# Altium schematic sheet 01- Title Page.SchDoc: Title page
size 386 x 246 mm; Date:: Friday, Nov 22, 2019; Page Number: 1; Page Size: B; Comment: Lattice Title Block New Brand; Page Count: 14; Board Rev: B; Project Name: CrossLink-NX Evaluation Board; RevCode: 1.0; Doc: 305-PD-19-0819; DsnPath: C:\Users\HAltinkilit\Downloads\Crosslink-NX-Design-Files\CrossLink-NX-Eval-Brd-Schematic-RevB-191122.DSN; SchematicName: SCHEMATIC1; PageName: 01- Title Page; PageSize: B; TopSchematic: True
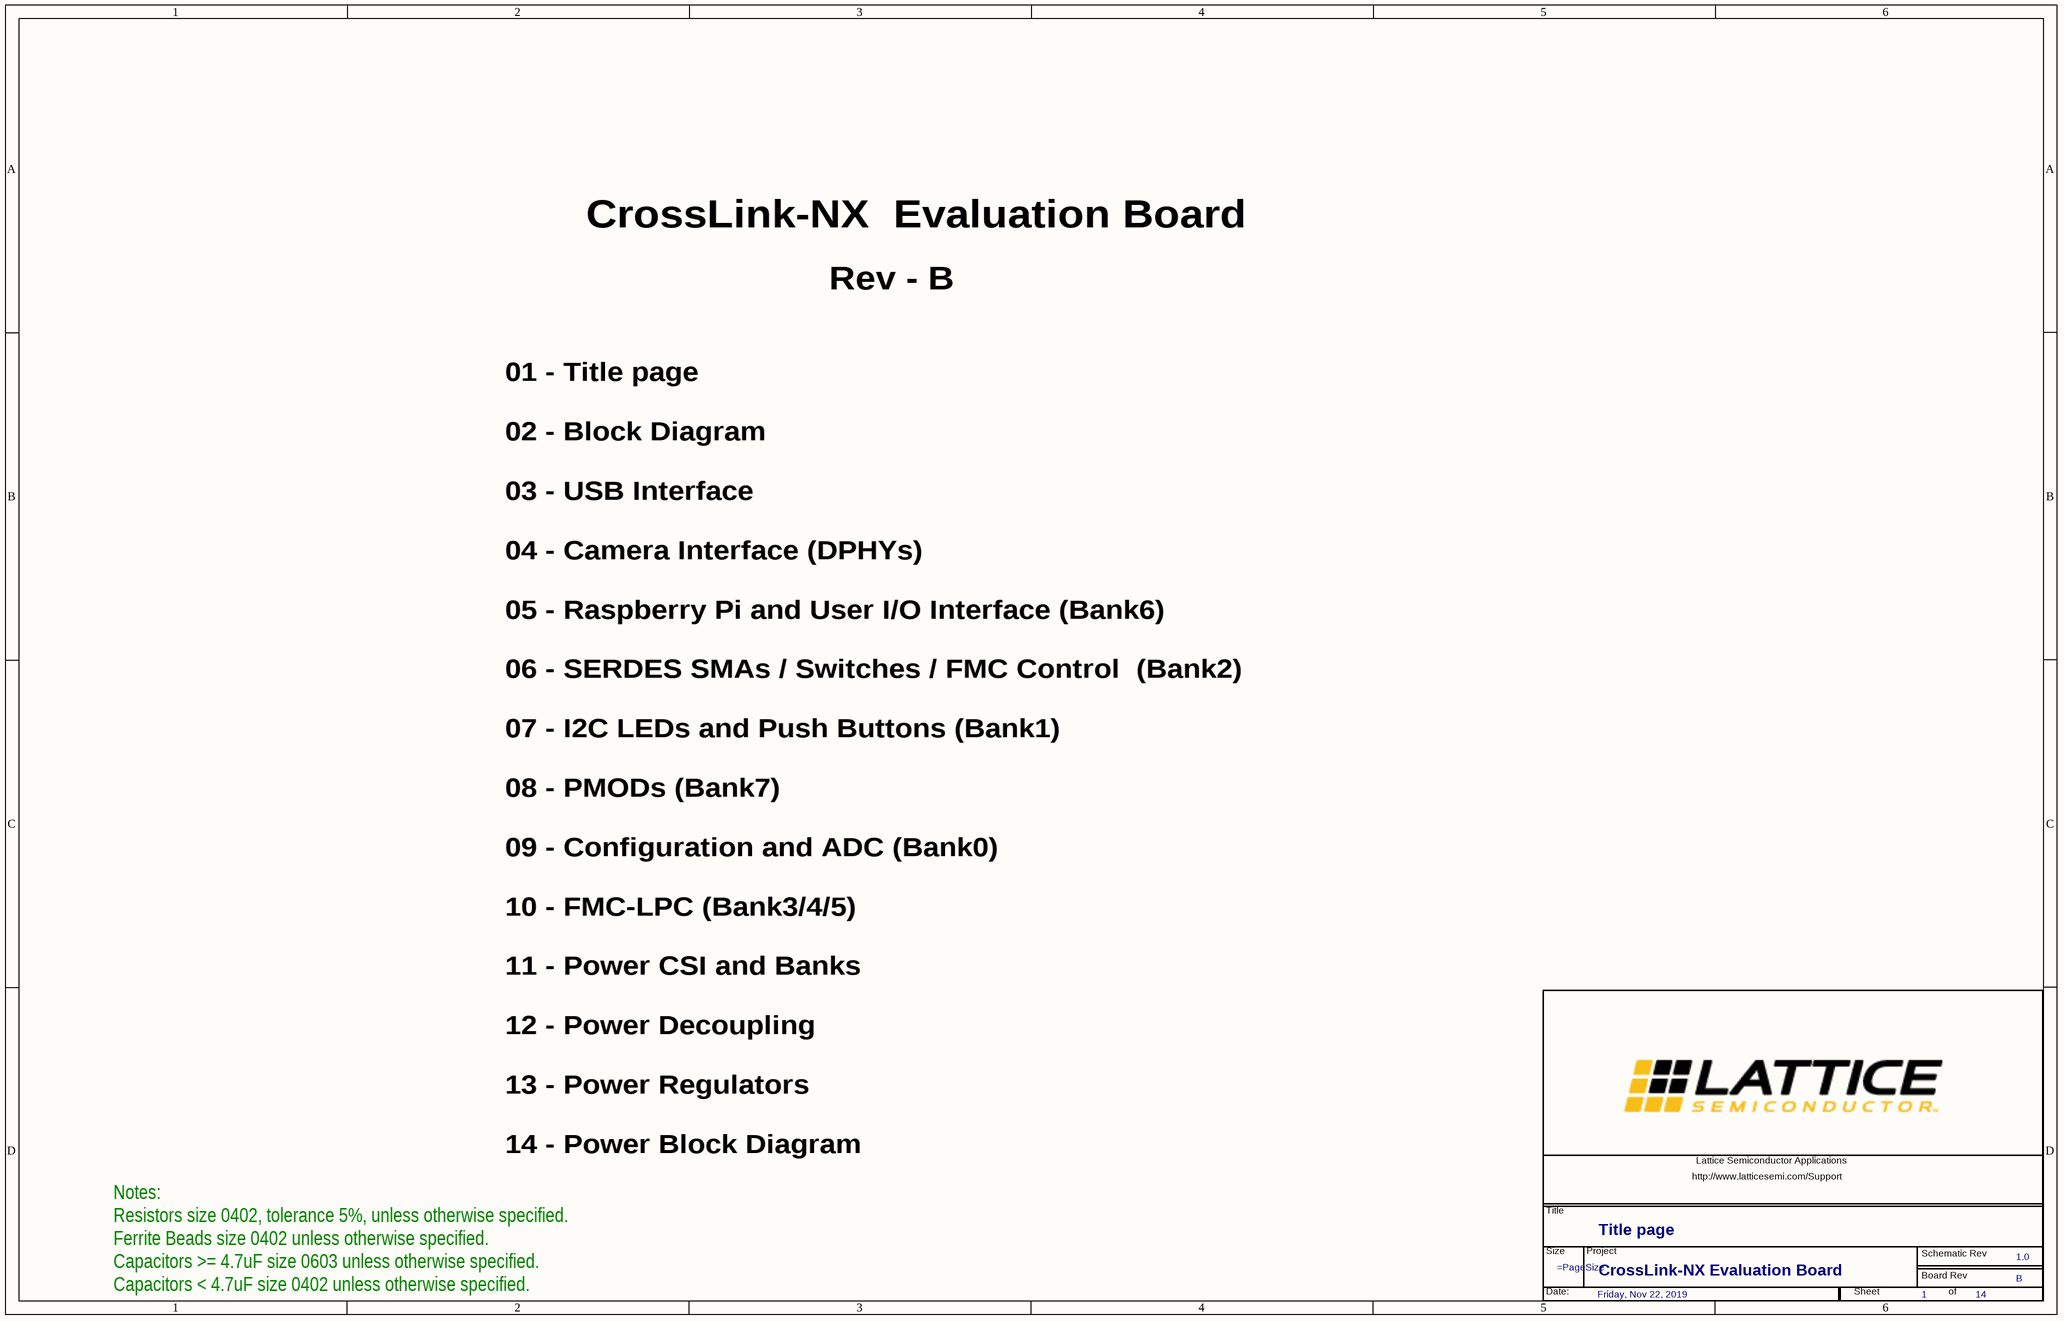
[diagram p0: 01- Title Page.SchDoc]

## Parts
*  Board Rev: B  Date:: Friday, Nov 22, 2019  RevCode: 1.0  Page Count: 14  Page Number: 1  Title: Title page  Project Name: CrossLink-NX Evaluation Board  (hidden comment: Lattice Title Block New Brand)  (graphical)

## Notes on the sheet
- CrossLink-NX  Evaluation Board
- Rev - B
- 01 - Title page
  02 - Block Diagram
  03 - USB Interface
  04 - Camera Interface (DPHYs)
  05 - Raspberry Pi and User I/O Interface (Bank6)
  06 - SERDES SMAs / Switches / FMC Control  (Bank2)
  07 - I2C LEDs and Push Buttons (Bank1)
  08 - PMODs (Bank7)
  09 - Configuration and ADC (Bank0)
  10 - FMC-LPC (Bank3/4/5)
  11 - Power CSI and Banks
  12 - Power Decoupling
  13 - Power Regulators
  14 - Power Block Diagram
- Notes:
  Resistors size 0402, tolerance 5%, unless otherwise specified.
  Ferrite Beads size 0402 unless otherwise specified.
  Capacitors >= 4.7uF size 0603 unless otherwise specified.
  Capacitors < 4.7uF size 0402 unless otherwise specified.
- (in symbol Lattice Title Block New Brand) Lattice Semiconductor Applications; http://www.latticesemi.com/Support; Title; Size; Project; Schematic Rev; Board Rev; Date:; Sheet; of

## Library data of the parts
* = Lattice Title Block New Brand: Doc: 305-PD-19-0819; Page Size: =PageSize